# Altium project usbmux.PrjPcb
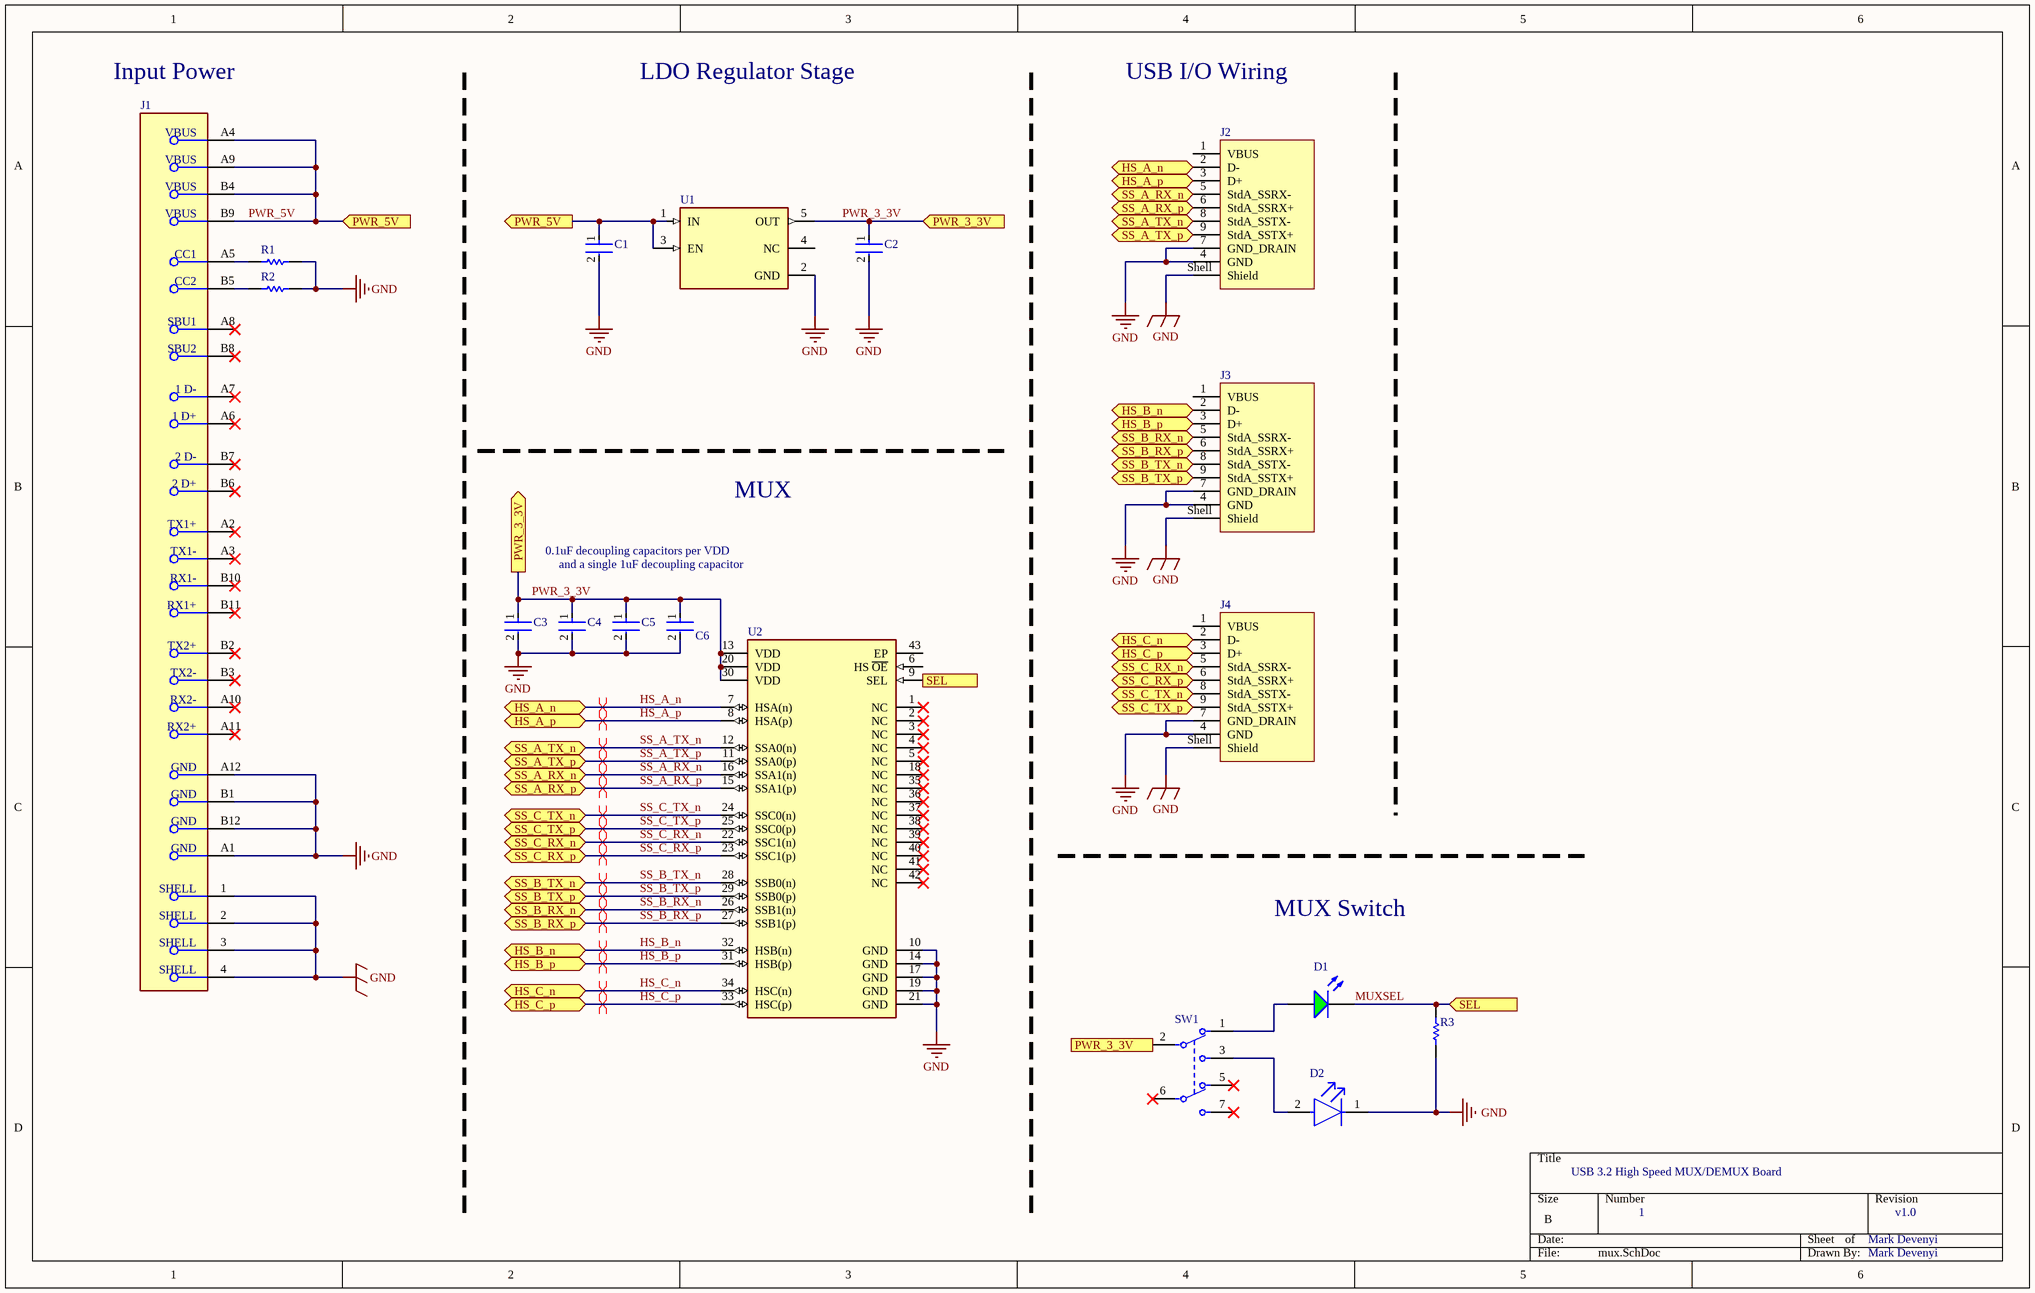
[diagram p0: mux.SchDoc]
1 sheet, 18 parts. Net scope: flat (ports and power ports of the same name join across sheets).
Board file: mux.PcbDoc

## Sheet mux.SchDoc
size B; SheetNumber: 1; SheetTotal: 1

### Parts
C1  (no value)  [FP-GRM155-0_05-IPC_B]
C2  (no value)  [FP-0603-L_1_6_0_25-W_0_8-IPC_B]
C3  (no value)  [FP-GRM155-0_05-IPC_A]
C4  (no value)  [FP-GRM155-0_05-IPC_A]
C5  (no value)  [FP-GRM155-0_05-IPC_A]
C6  (no value)  [FP-0603-L_1_6_0_25-W_0_8-IPC_B]
D1  (no value)  [KING-WP7113SGD_V]
D2  (no value)  [FP-SSL-LX5093YD-MFG]
J1  (no value)  [FP-12401832E402A-MFG]
J2  (no value)  [692122030100]
J3  (no value)  [692122030100]
J4  (no value)  [692122030100]
R1  (no value)  [RESC1005X35X20NL05T10]
R2  (no value)  [RESC1005X35X20NL05T10]
R3  (no value)  [RESC1005X35X20ML05T10]
SW1  (no value)  [FP-JS202011JCQN-MFG]
U1  (no value)  [FP-DBV0005A-IPC_B]
U2  (no value)  [FP-RUA0042A-IPC_B]

### Ports
HS_A_n (bidir), HS_A_p (bidir), HS_B_n (bidir), HS_B_p (bidir), HS_C_n (bidir), HS_C_p (bidir), PWR_3_3V (in), PWR_3_3V (out), PWR_5V (in), PWR_5V (out), SEL (in), SEL (out), SS_A_RX_n (bidir), SS_A_RX_p (bidir), SS_A_TX_n (bidir), SS_A_TX_p (bidir), SS_B_RX_n (bidir), SS_B_RX_p (bidir), SS_B_TX_n (bidir), SS_B_TX_p (bidir), SS_C_RX_n (bidir), SS_C_RX_p (bidir), SS_C_TX_n (bidir), SS_C_TX_p (bidir)

### Nets
 GND: C1.2 C2.2 C3.2 C4.2 C5.2 C6.2 D2.1(C) J1.1(SHELL) J1.2(SHELL) J1.3(SHELL) J1.4(SHELL) J1.A1(GND) J1.A12(GND) J1.B1(GND) J1.B12(GND) J2.4(GND) J2.7(GND_DRAIN) J2.Shell(Shield) J3.4(GND) J3.7(GND_DRAIN) J3.Shell(Shield) J4.4(GND) J4.7(GND_DRAIN) J4.Shell(Shield) R1.2 R2.2 R3.1 U1.2(GND) U2.10(GND) U2.14(GND) U2.17(GND) U2.19(GND) U2.21(GND)  [also labelled GND]
HS_A_n: J2.2(D-) U2.7(HSA(n)) ; port HS_A_n
HS_A_p: J2.3(D+) U2.8(HSA(p)) ; port HS_A_p
HS_B_n: J3.2(D-) U2.32(HSB(n)) ; port HS_B_n
HS_B_p: J3.3(D+) U2.31(HSB(p)) ; port HS_B_p
HS_C_n: J4.2(D-) U2.34(HSC(n)) ; port HS_C_n
HS_C_p: J4.3(D+) U2.33(HSC(p)) ; port HS_C_p
MUXSEL: D1.2(K) R3.2 U2.9(SEL) ; port SEL
PWR_3_3V: C2.1 C3.1 C4.1 C5.1 C6.1 SW1.2(1_C) U1.5(OUT) U2.13(VDD) U2.20(VDD) U2.30(VDD) ; port PWR_3_3V
PWR_5V: C1.1 J1.A4(VBUS) J1.A9(VBUS) J1.B4(VBUS) J1.B9(VBUS) U1.1(IN) U1.3(EN) ; port PWR_5V
SS_A_RX_n: J2.5(StdA_SSRX-) U2.16(SSA1(n)) ; port SS_A_RX_n
SS_A_RX_p: J2.6(StdA_SSRX+) U2.15(SSA1(p)) ; port SS_A_RX_p
SS_A_TX_n: J2.8(StdA_SSTX-) U2.12(SSA0(n)) ; port SS_A_TX_n
SS_A_TX_p: J2.9(StdA_SSTX+) U2.11(SSA0(p)) ; port SS_A_TX_p
SS_B_RX_n: J3.5(StdA_SSRX-) U2.26(SSB1(n)) ; port SS_B_RX_n
SS_B_RX_p: J3.6(StdA_SSRX+) U2.27(SSB1(p)) ; port SS_B_RX_p
SS_B_TX_n: J3.8(StdA_SSTX-) U2.28(SSB0(n)) ; port SS_B_TX_n
SS_B_TX_p: J3.9(StdA_SSTX+) U2.29(SSB0(p)) ; port SS_B_TX_p
SS_C_RX_n: J4.5(StdA_SSRX-) U2.22(SSC1(n)) ; port SS_C_RX_n
SS_C_RX_p: J4.6(StdA_SSRX+) U2.23(SSC1(p)) ; port SS_C_RX_p
SS_C_TX_n: J4.8(StdA_SSTX-) U2.24(SSC0(n)) ; port SS_C_TX_n
SS_C_TX_p: J4.9(StdA_SSTX+) U2.25(SSC0(p)) ; port SS_C_TX_p
NetD1_1: D1.1(A) SW1.1
NetD2_2: D2.2(A) SW1.3
NetJ1_A5: J1.A5(CC1) R1.1
NetJ1_B5: J1.B5(CC2) R2.1

Not connected (* = marked no-connect by the designer): J1 A2(TX1+)* A3(TX1-)* A6(1_D+)* A7(1_D-)* A8(SBU1)* A10(RX2-)* A11(RX2+)* B2(TX2+)* B3(TX2-)* B6(2_D+)* B7(2_D-)* B8(SBU2)* B10(RX1-)* B11(RX1+)*; J2 1(VBUS); J3 1(VBUS); J4 1(VBUS); SW1 5* 6(2_C)* 7*; U1 4(NC); U2 1(NC)* 2(NC)* 3(NC)* 4(NC)* 5(NC)* 6(HS_~{OE}) 18(NC)* 35(NC)* 36(NC)* 37(NC)* 38(NC)* 39(NC)* 40(NC)* 41(NC)* 42(NC)* 43(EP)

### Layout directives
differential pair: HS_A_n, HS_A_p, HS_B_n, HS_B_p, HS_C_n, HS_C_p, SS_A_RX_n, SS_A_RX_p, SS_A_TX_n, SS_A_TX_p, SS_B_RX_n, SS_B_RX_p, SS_B_TX_n, SS_B_TX_p, SS_C_RX_n, SS_C_RX_p, SS_C_TX_n, SS_C_TX_p

### Notes on the sheet
- Input Power
- LDO Regulator Stage
- USB I/O Wiring
- MUX
- 0.1uF decoupling capacitors per VDD
- and a single 1uF decoupling capacitor
- MUX Switch
- USB 3.2 High Speed MUX/DEMUX Board
- 1
- Mark Devenyi
- v1.0

### Library data of the parts
C1 C3-C5 = CMP-2008-04639-2: Chip Multilayer Ceramic Capacitors for General Purpose, 0402, 0.10uF, X7R, 15%, 10%, 50V; Dissipation Factor: 0.025%; Capacitance: 100nF; Weight: 0.000212oz; Thickness: 0.022inch; Voltage Rating (DC): 50V; Dielectric Material: Ceramic; Termination: SMD/SMT; Case/Package: 0402; Case Code (Imperial): 0402; Mount: Surface Mount; REACH SVHC: No SVHC; Resistor Type: Ceramic; Dielectric: X7R; Max Operating Temperature: 125°C; Voltage: 50V; Lead Free: Lead Free; Package Quantity: 10000; Packaging: Tape and Reel; Length: 1mm; Material: Ceramic; Height: 0.5mm; Depth: 0.5mm; Width: 0.5mm; Min Operating Temperature: -55°C; Tolerance: 10%; Case Code (Metric): 1005; Voltage Rating: 50V
C2 C6 = CMP-14477-003797-3: CAP CER 1UF 25V X7R 0603; Tolerance: 10%; Case Code (Imperial): 0603; RoHS Compliant: Yes; Features: Soft Termination; Capacitance: 1uF; Case/Package: 0603; Voltage Rating: 25V; Case Code (Metric): 1608; Thickness: 0.035inch; Ratings: AEC-Q200; Mount: Surface Mount; Packaging: Cut Tape; Min Operating Temperature: -55°C; Length: 0.063inch; Max Operating Temperature: 125°C; Width: 0.031inch
D1 = CMP-2100-03698-1: LED Green, 62.5 mW, 25 mA, -40 to 85 degC, 2-Pin THD, RoHS, Bulk; Manufacturer: Kingbright; Viewing Angle: 30degrees; Lens Style: Tinted; Test Current: 20mA; Forward Voltage: 2.2V; Wavelength: 568nm; Luminous Intensity: 40mcd; Package Reference: WP7113SGD; Colour: Green; Lead Free: LeadFree; Packaging: Bulk; RoHSCompliant: true; Package Quantity: 1000; Illumination Colour: Green; Case/Package: Radial; Datasheet URL: http://www.kingbrightusa.com/images/catalog/SPEC/WP7113SGD.pdf; Dominant Wavelength: 568nm; Datasheet Version: Rev. 6B, 01/2015; Package Description: 2-Pin Through Hole Device, Dia 5.9 mm, Body Length 8.6 mm; Height: 8.6mm
D2 = CMP-57192-000007-1: LED YELLOW DIFFUSED T-1 3/4 T/H; Test Current: 20mA; Number of LEDs: 1; Dominant Wavelength: 568nm; Wavelength: 585nm; Forward Voltage: 2.1V; Lens Style: Dome; Viewing Angle: 60°; Luminous Intensity: 30mcd; Min Operating Temperature: -40°C; Packaging: Bulk; Width: 1.5inch; Lead Free: Lead Free; Number of Pins: 2; Color: Yellow; Case/Package: Radial; Forward Current: 20mA; REACH SVHC: No SVHC; Lens Transparency: Diffused; Weight: 0.01lb; Height: 8.6mm; Package Quantity: 1000; Series: -; Length: 0.5inch; Illumination Color: Yellow; Mount: Through Hole; Diameter: 5mm; RoHS Compliant: Yes; Lens Color: Yellow; Max Operating Temperature: 85°C
J1 = CMP-02355-000004-1: CONN RCP USB3.1 TYPEC 24P SMD RA
J2-J4 = CMP-1502-03220-3: Conn USB 3.0 Type A RCP 9 POS 1.25mm Solder RA SMD 9 Terminal 1 Port T/R; Current Rating: 250mA; Insulation Resistance: 100MΩ; Number of Contacts: 9; Number of Ports: 1; Voltage Rating (AC): 30V; USB Standard: USB 3.0; Gender: Receptacle; Contact Resistance: 50mΩ; RoHS: Compliant; Min Operating Temperature: -20°C; Packaging: Tape and Reel; Width: 16.66mm; Contact Plating: Gold; Color: Blue; Height: 8.01mm; Mount: Horizontal, Surface Mount, Through Hole; Voltage Rating: 30V; Contact Material: Gold, Nickel; Connector Type: USB; REACH SVHC: Unknown; Number of Pins: 9; Max Operating Temperature: 85°C; Operating Supply Voltage: 30V; Lead Free: Lead Free; Termination: SMD/SMT; Orientation: Horizontal; Flammability Rating: UL94 V-0; Features: Shielded; Length: 15.1mm
R1-R3 = CMP-2002-03342-1: Manufacturer: TE Connectivity / AMP; Part Number: CPF0402B5K1E1
SW1 = CMP-10038-000009-1: SWITCH SLIDE DPDT 300MA 6V; Actuator Material: Nylon; Actuator Length: 2mm; Actuator Type: Standard; Electrical Life: 5000Cycles; Switch Function: On-On; Mount: Surface Mount; Current Rating: 300mA; Contact Material: Copper Alloy; Voltage Rating (DC): 6V; Throw Configuration: DPDT; Packaging: Cut Tape; Contact Plating: Silver; Min Operating Temperature: -40°C; Switch Travel: 2mm; Max Operating Temperature: 85°C
U1 = CMP-04917-000184-2: None; Min Output Voltage: 3.3V; Number of Regulators: 1; Max Supply Current: 75uA; Max Input Voltage: 5.5V; Output Type: Fixed; Dropout Voltage: 540mV; Output Configuration: Positive; Quiescent Current: 50uA; Output Current: 150mA; Power Supply Rejection Ratio (PSRR): 55dB; RoHS Compliant: Yes; Case/Package: SOT-23-5; Packaging: Tape and Reel; Min Operating Temperature: -40°C; Mount: Surface Mount; Max Operating Temperature: 125°C
U2 = CMP-04877-000017-1: IC MUX 2:1 8 OHM 42WQFN; On-State Resistance: 8R; Turn-Off Delay Time: 250ns; USB Standard: USB 2.0; Number of Ports: 3; Operating Supply Voltage: 3.3V; Data Rate: 10Gbps; Supply Type: Single; Max Supply Voltage: 3.6V; Bandwidth: 10GHz; Min Supply Voltage: 3V; Logic Function: Multiplexer; Operating Supply Current: 2.4mA; Min Operating Temperature: 0°C; REACH SVHC: No SVHC; Package Quantity: 3000; RoHS Compliant: Yes; Radiation Hardening: No; Lead Free: Lead Free; Packaging: Tape and Reel; Number of Pins: 42; Mount: Surface Mount; Max Operating Temperature: 70°C; Number of Channels: 3; Turn-On Delay Time: 250ns; Weight: 0.001933oz